# Altium schematic sheet SWAP_21DD_ LV_DR_Brush_Rev1.2.SchDoc
size Letter
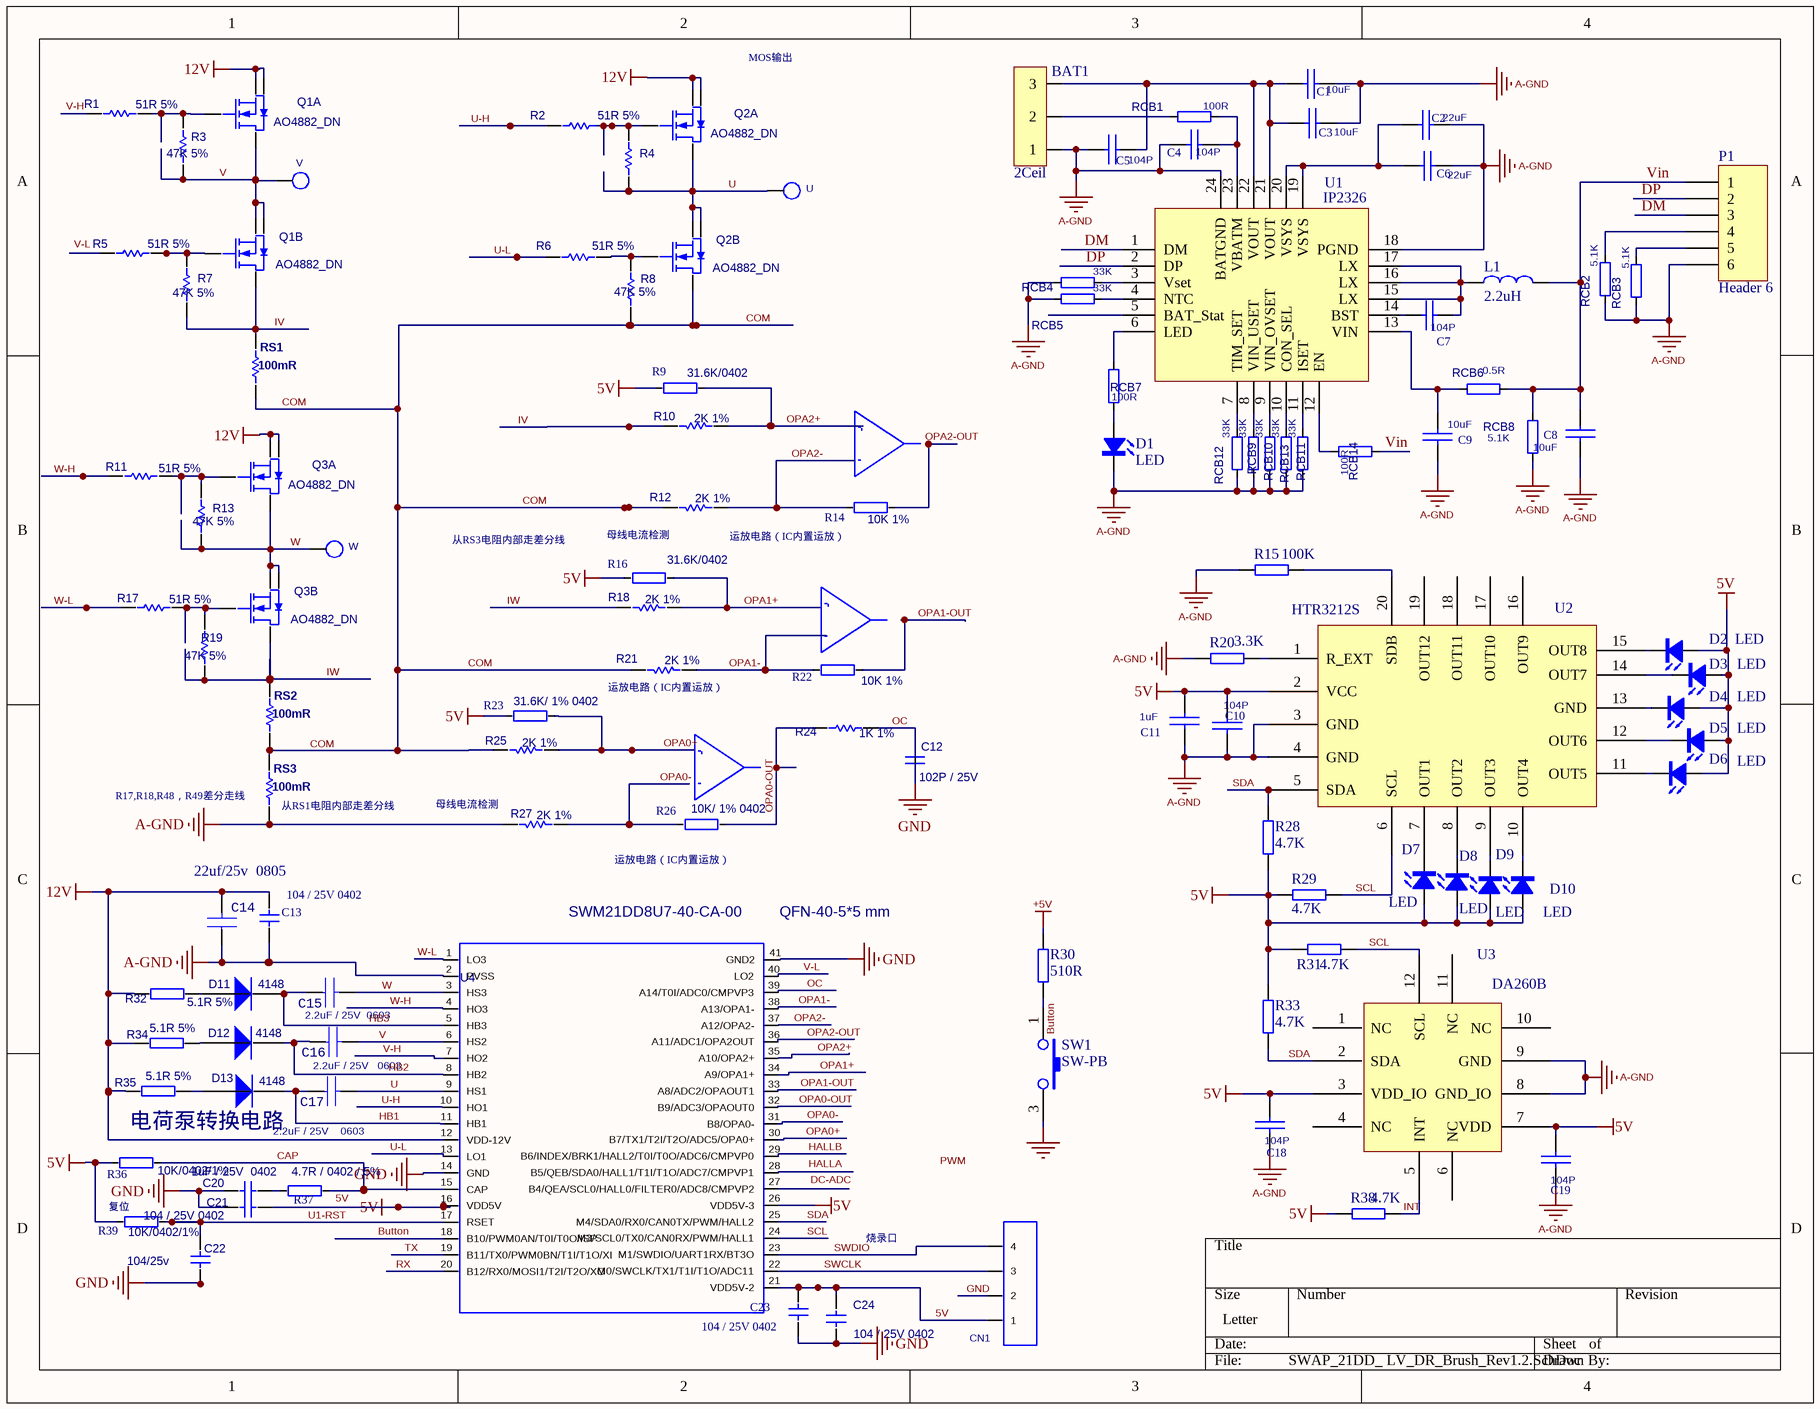
[diagram p0: SWAP_21DD_ LV_DR_Brush_Rev1.2.SchDoc]

## Parts
BAT1  2Ceil  [HDR1X3]
C1  10uF  [LC-0603_R]
C2  22uF  [LC-0603_R]
C3  10uF  [LC-0603_R]
C4  104P  [LC-0603_R]
C5  104P  [LC-0603_R]
C6  22uF  [LC-0603_R]
C7  104P  [LC-0603_R]
C8  10uF  [LC-0603_R]
C9  10uF  [LC-0603_R]
C10  104P  [LC-0603_R]
C11  1uF  [LC-0603_R]
C12  102P / 25V  [LC-0402_C]
C13  104 / 25V 0402  [LC-0402_C]
C14  22uf/25v  0805  [LC-0805_C]
C15  2.2uF / 25V  0603  [LC-0603_C]
C16  2.2uF / 25V   0603  [LC-0603_C]
C17  2.2uF / 25V    0603  [LC-0603_C]
C18  104P  [LC-0603_R]
C19  104P  [LC-0603_R]
C20  1uF / 25V  0402  [LC-0402_C]
C21  104 / 25V 0402  [LC-0402_C]
C22  104/25v  [LC-0402_C]
C23  104 / 25V 0402  [LC-0402_C]
C24  104 / 25V 0402  [LC-0402_C]
CN1  SWD1  [4P-2.54-8]  (value not drawn)
D1  LED  [D0603-B]
D2  LED  [D0603-B]
D3  LED  [D0603-B]
D4  LED  [D0603-B]
D5  LED  [D0603-B]
D6  LED  [D0603-B]
D7  LED  [D0603-B]
D8  LED  [D0603-B]
D9  LED  [D0603-B]
D10  LED  [D0603-B]
D11  4148  [LC-SOD-323]
D12  4148  [LC-SOD-323]
D13  4148  [LC-SOD-323]
L1  2.2uH  [L-5X4]
P1  Header 6  [HDR1X6]
Q1  AO4882_DN  [LC-SOP-8_150mil]  (parts A,B of 2)
Q2  AO4882_DN  [LC-SOP-8_150mil]  (parts A,B of 2)
Q3  AO4882_DN  [LC-SOP-8_150mil]  (parts A,B of 2)
R1  51R 5%  [LC-0402_R]
R2  51R 5%  [LC-0402_R]
R3  47K 5%  [LC-0402_R]
R4  47K 5%  [LC-0402_R]  (value not drawn)
R5  51R 5%  [LC-0402_R]
R6  51R 5%  [LC-0402_R]
R7  47K 5%  [LC-0402_R]
R8  47K 5%  [LC-0402_R]
R9  31.6K/0402  [LC-0402_R]
R10  2K 1%  [LC-0402_R]
R11  51R 5%  [LC-0402_R]
R12  2K 1%  [LC-0402_R]
R13  47K 5%  [LC-0402_R]
R14  10K 1%  [LC-0402_R]
R15  100K  [R 0603]
R16  31.6K/0402  [LC-0402_R]
R17  51R 5%  [LC-0402_R]
R18  2K 1%  [LC-0402_R]
R19  47K 5%  [LC-0402_R]
R20  3.3K  [R 0603]
R21  2K 1%  [LC-0402_R]
R22  10K 1%  [LC-0402_R]
R23  31.6K/ 1% 0402  [LC-0402_R]
R24  1K 1%  [LC-0402_R]
R25  2K 1%  [LC-0402_R]
R26  10K/ 1% 0402  [LC-0402_R]
R27  2K 1%  [LC-0402_R]
R28  4.7K  [R 0603]
R29  4.7K  [R 0603]
R30  510R  [R 0603]
R31  4.7K  [R 0603]
R32  5.1R 5%  [LC-0603_R]
R33  4.7K  [R 0603]
R34  5.1R 5%  [LC-0603_R]
R35  5.1R 5%  [LC-0603_R]
R36  10K/0402/1%  [LC-0402_R]
R37  4.7R / 0402 / 5%  [LC-0402_R]
R38  4.7K  [R 0603]
R39  10K/0402/1%  [LC-0402_R]
RCB1  100R  [LC-0603_R]
RCB2  5.1K  [LC-0603_R]
RCB3  5.1K  [LC-0603_R]
RCB4  33K  [LC-0603_R]
RCB5  33K  [LC-0603_R]
RCB6  0.5R  [LC-0603_R]
RCB7  100R  [LC-0603_R]
RCB8  5.1K  [LC-0603_R]
RCB9  33K  [LC-0603_R]
RCB10  33K  [LC-0603_R]
RCB11  33K  [LC-0603_R]
RCB12  33K  [LC-0603_R]
RCB13  33K  [LC-0603_R]
RCB14  100R  [LC-0603_R]
RS1  100mR  [LC-1206_R]
RS2  100mR  [LC-1206_R]
RS3  100mR  [LC-1206_R]
SW1  SW-PB  [SW]
T1  value V  [MARK]  (hidden comment: TEST)
T2  value U  [MARK]  (hidden comment: TEST)
T3  value W  [MARK]  (hidden comment: TEST)
U1  IP2326  [QFN-24]
U2  HTR3212S  [SOP-20]
U3  DA260B  [SOIC-16]
U4  QFN32  [QFN32]  (value not drawn)

## Nets
5V: C10.1 C11.1 C18.1 C19.1 C21.1 C23.2 C24.2 CN1.1 D2.A D3.A D4.A D5.A D6.A D7.A D8.A D9.A D10.A R9.2 R16.2 R23.2 R28.2 R29.1 R31.1 R33.2 R36.1 R38.2 R39.1 U2.2(VCC) U3.3(VDD_IO) U3.7(VDD) U4.16(VDD5V) U4.21(VDD5V-2) U4.26(VDD5V-3)
12V: C13.2 C14.2 Q1.7(D) Q1.8(D) Q2.7(D) Q2.8(D) Q3.7(D) Q3.8(D) R32.1 R34.1 R35.1 U4.12(VDD-12V)
+5V: R30.1
A-GND: BAT1.1 C1.1 C2.1 C3.1 C4.2 C5.2 C6.1 C8.2 C9.2 C10.2 C11.2 C13.1 C14.1 C18.2 C19.2 D1.K P1.6 R15.2 R20.2 R27.1 RCB2.2 RCB3.2 RCB4.2 RCB5.2 RCB8.2 RCB9.2 RCB10.2 RCB11.2 RCB12.2 RCB13.2 RS3.1 U1.18(PGND) U1.24(BATGND) U2.3(GND) U2.4(GND) U3.8(GND_IO) U3.9(GND) U4.2(PVSS)
GND: C12.1 C20.1 C21.2 C22.2 C23.1 C24.1 CN1.2 SW1.3 U4.14(GND) U4.41(GND2)
Button: R30.2 SW1.1 U4.18(B10/PWM0AN/T0I/T0O/ISP)
CAP: R36.2 R37.2 U4.15(CAP)
COM: Q2.3(S) R8.1 R12.1 R21.1 R25.1 RS1.1 RS2.1 RS3.2
DM: P1.3 U1.1(DM)
DP: P1.2 U1.2(DP)
HALLA: U4.28(B5/QEB/SDA0/HALL1/T1I/T1O/ADC7/CMPVP1)
HALLB: U4.29(B6/INDEX/BRK1/HALL2/T0I/T0O/ADC6/CMPVP0)
HB1: C17.1 D13.2(K) U4.11(HB1)
HB2: C16.1 D12.2(K) U4.8(HB2)
HB3: C15.1 D11.2(K) U4.5(HB3)
INT: R38.1 U3.5(INT)
IV: Q1.3(S) R7.1 R10.1 RS1.2
IW: Q3.3(S) R18.1 R19.1 RS2.2
OC: C12.2 R24.2 U4.39(A14/T0I/ADC0/CMPVP3)
OPA0+: R23.1 R25.2 U4.30(B7/TX1/T2I/T2O/ADC5/OPA0+)
OPA0-: R26.2 R27.2 U4.31(B8/OPA0-)
OPA0-OUT: R24.1 R26.1 U4.32(B9/ADC3/OPAOUT0)
OPA1+: R16.1 R18.2 U4.34(A9/OPA1+)
OPA1-: R21.2 R22.2 U4.38(A13/OPA1-)
OPA1-OUT: R22.1 U4.33(A8/ADC2/OPAOUT1)
OPA2+: R9.1 R10.2 U4.35(A10/OPA2+)
OPA2-: R12.2 R14.2 U4.37(A12/OPA2-)
RX: U4.20(B12/RX0/MOSI1/T2I/T2O/XO)
SCL: R29.2 R31.2 U2.6(SCL) U3.12(SCL) U4.24(M3/SCL0/TX0/CAN0RX/PWM/HALL1)
SDA: R28.1 R33.1 U2.5(SDA) U3.2(SDA) U4.25(M4/SDA0/RX0/CAN0TX/PWM/HALL2)
SWCLK: CN1.3 U4.22(M0/SWCLK/TX1/T1I/T1O/ADC11)
SWDIO: CN1.4 U4.23(M1/SWDIO/UART1RX/BT3O)
TX: U4.19(B11/TX0/PWM0BN/T1I/T1O/XI)
U: C17.2 Q2.1(S) Q2.5(D) Q2.6(D) R4.1 T2.1 U4.9(HS1)
U1-RST: C22.1 R39.2 U4.17(RSET)
U-H: R2.1 U4.10(HO1)
U-L: R6.1 U4.13(LO1)
V: C16.2 Q1.1(S) Q1.5(D) Q1.6(D) R3.1 T1.1 U4.6(HS2)
V-H: R1.1 U4.7(HO2)
V-L: U4.40(LO2)
Vin: C8.1 L1.1 P1.1 RCB6.2 RCB8.1 RCB14.2
W: C15.2 Q3.1(S) Q3.5(D) Q3.6(D) R13.1 T3.1 U4.3(HS3)
W-H: R11.1 U4.4(HO3)
W-L: R17.1 U4.1(LO3)
NetBAT1_2: BAT1.2 RCB1.2
NetBAT1_3: BAT1.3 C1.2 C3.2 C5.1 U1.21(VOUT) U1.22(VOUT)
NetC2_2: C2.2 C6.2 U1.19(VSYS) U1.20(VSYS)
NetC4_1: C4.1 RCB1.1 U1.23(VBATM)
NetC7_1: C7.1 U1.14(BST)
NetC7_2: C7.2 L1.2 U1.15(LX) U1.16(LX) U1.17(LX)
NetC9_1: C9.1 RCB6.1 U1.13(VIN)
NetC20_2: C20.2 R37.1
NetD1_A: D1.A RCB7.1
NetD2_K: D2.K U2.15(OUT8)
NetD3_K: D3.K U2.14(OUT7)
NetD4_K: D4.K U2.13(GND)
NetD5_K: D5.K U2.12(OUT6)
NetD6_K: D6.K U2.11(OUT5)
NetD7_K: D7.K U2.7(OUT1)
NetD8_K: D8.K U2.8(OUT2)
NetD9_K: D9.K U2.9(OUT3)
NetD10_K: D10.K U2.10(OUT4)
NetD11_1: D11.1(A) R32.2
NetD12_1: D12.1(A) R34.2
NetD13_1: D13.1(A) R35.2
NetP1_4: P1.4 RCB2.1
NetP1_5: P1.5 RCB3.1
NetQ1_2: Q1.2(G) R1.2 R3.2
NetQ1_4: Q1.4(G) R5.2
NetQ2_2: Q2.2(G) R2.2 R4.2
NetQ2_4: Q2.4(G) R6.2 R8.2
NetQ3_2: Q3.2(G) R11.2 R13.2
NetQ3_4: Q3.4(G) R17.2 R19.2
NetR15_1: R15.1 U2.20(SDB)
NetR20_1: R20.1 U2.1(R_EXT)
NetRCB4_1: RCB4.1 U1.3(Vset)
NetRCB5_1: RCB5.1 U1.4(NTC)
NetRCB7_2: RCB7.2 U1.6(LED)
NetRCB9_1: RCB9.1 U1.8(VIN_USET)
NetRCB10_1: RCB10.1 U1.9(VIN_OVSET)
NetRCB11_1: RCB11.1 U1.11(ISET)
NetRCB12_1: RCB12.1 U1.7(TIM_SET)
NetRCB13_1: RCB13.1 U1.10(CON_SEL)
NetRCB14_1: RCB14.1 U1.12(EN)

Not connected (* = marked no-connect by the designer): R5 1; R7 2; R14 1; U1 5(BAT_Stat); U2 16(OUT9) 17(OUT10) 18(OUT11) 19(OUT12); U3 1(NC) 4(NC) 6(NC) 10(NC) 11(NC); U4 27(B4/QEA/SCL0/HALL0/FILTER0/ADC8/CMPVP2) 36(A11/ADC1/OPA2OUT)

## Notes on the sheet
- (near Q2) MOS输出
- 从RS3电阻内部走差分线
- 母线电流检测
- (near R12) 运放电路（IC内置运放）
- (near R21) 运放电路（IC内置运放）
- R17,R18,R48，R49差分走线
- (near RS3) 从RS1电阻内部走差分线
- (near R26) 运放电路（IC内置运放）
- (near U4) SWM21DD8U7-40-CA-00
- (near U4) QFN-40-5*5 mm
- 电荷泵转换电路
- (near R39) 复位
- 烧录口
- Labels drawn without touching a wire or pin: 5V, DC-ADC, OPA2-OUT, PWM, V-L

## Library data of the parts
BAT1 = BAT: Connector
C1-C11 C18 C19 = CC: Capacitor; PCB DECAL: C0603
C12 = C0603: 贴片瓷片电容; Value: 100nF; Published: 8-Jun-2000; LatestRevisionDate: 17-Jul-2002; LatestRevisionNote: Re-released for DXP Platform.; PackageReference: RAD-0.3; Publisher: Altium Limited; PCB DECAL: C0603; Comment_1: C0603
C13 C20-C24 = CAP_S: PCB DECAL: C0603; Comment_1: CAP_S
C14 = C0805: SMT Resistor 5% UniOhm(厚声); Part_Shape: 0603; Source_Path: E:\GTCS-A01-SWM-P9项目\GTCS-A01-SWM-P9项目V1.2\GTCS-A01-SWM-P9-V1.2.原理图\99.DSN; ValueRank: 33R; ForPin: Pin; Designator: R1C; Contributor: LCEDA_Lib; Published: 8-Jun-2000; LatestRevisionDate: 17-Jul-2002; LatestRevisionNote: Re-released for DXP Platform.; PackageReference: 0805; Publisher: Altium Limited; PackageDescription: Radial Cap, Thru-Hole; 2 Leads; 0.3 in Pin Spacing; PCB DECAL: C0805; MountType: SMT; Footprint: 0805; Accuracy: 5%; spicePre: R; spiceSymbolName: R_0603_EU; Comment_1: C0805
C15-C17 = C0805: Part_Shape: 0603; Source_Path: E:\GTCS-A01-SWM-P9项目\GTCS-A01-SWM-P9项目V1.2\GTCS-A01-SWM-P9-V1.2.原理图\99.DSN; PCB DECAL: C0805
CN1 = 4P-2.54-8: 接插件  DS-5.1CN4  DS-2.54CWB-4; PCB DECAL: 4P-2.54-8; Comment_1: 4P-2.54-8
D11-D13 = DIODE: Default Diode; PCB DECAL: SOD-123/3; Published: 8-Jun-2000; LatestRevisionDate: 17-Jul-2002; LatestRevisionNote: Re-released for DXP Platform.; PackageVersion: Sep-1996; PackageReference: SMC; Publisher: Altium Limited; PackageDescription: DO-214-AB/SMC; 2 C-Bend Leads; Body 7.9 x 5.9 mm, inc. leads (LxW); Code_JEDEC: DO-214-AB; Comment_1: DIODE
L1 = L - 5x4: 电感
P1 = Header 6: Header, 6-Pin; LatestRevisionDate: 17-Jul-2002; LatestRevisionNote: Re-released for DXP Platform.; Publisher: Altium Limited
Q1-Q3 = AO4882_DN_SOP8: MOS(场效应管)
R1-R8 R10-R13 R17-R19 R21 R25 R27 = RES_SEMI: Semiconductor Resistor; Value: 1K; PCB DECAL: R0603; Published: 8-Jun-2000; LatestRevisionDate: 17-Jul-2002; LatestRevisionNote: Re-released for DXP Platform.; PackageReference: AXIAL-0.5; Publisher: Altium Limited; PackageDescription: Axial Device, Thru-Hole; 2 Leads; 0.5 in Pin Spacing; Comment_1: RES_SEMI
R9 R14 R16 R22 R23 R26 R36 R37 R39 = R0402: 贴片电阻; Value: 1K; PCB DECAL: R0603; Published: 8-Jun-2000; LatestRevisionDate: 17-Jul-2002; LatestRevisionNote: Re-released for DXP Platform.; Publisher: Altium Limited; Comment_1: R0402
  R9 R14 R16 R22 R23 R26: PackageReference: AXIAL-0.5; PackageDescription: Axial Device, Thru-Hole; 2 Leads; 0.5 in Pin Spacing
  R36 R37 R39: PackageReference: AXIAL-0.4
R15 R20 R28-R31 R33 R38 = R: Resistance
R24 = RES_SEMI: Semiconductor Resistor; PCB DECAL: R0603; Published: 8-Jun-2000; LatestRevisionDate: 17-Jul-2002; LatestRevisionNote: Re-released for DXP Platform.; PackageReference: AXIAL-0.5; Publisher: Altium Limited; PackageDescription: Axial Device, Thru-Hole; 2 Leads; 0.5 in Pin Spacing; Value: 1K; Comment_1: RES_SEMI
R32 R34 R35 = RES_T: PCB DECAL: R1206; Comment_1: RES_T
RCB1-RCB14 = RR: 贴片 电阻器; Value: 1K; PCB DECAL: R0603; SMD/DIP/WELDING: SMD; Published: 8-Jun-2000; LatestRevisionDate: 17-Jul-2002; LatestRevisionNote: Re-released for DXP Platform.; PackageReference: AXIAL-0.5; Publisher: Altium Limited; PackageDescription: Axial Device, Thru-Hole; 2 Leads; 0.5 in Pin Spacing
RS1-RS3 = RES_2512: Semiconductor Resistor; Value: 1K; PCB DECAL: 2512R_6332; Published: 8-Jun-2000; LatestRevisionDate: 17-Jul-2002; LatestRevisionNote: Re-released for DXP Platform.; PackageReference: AXIAL-0.5; Publisher: Altium Limited; PackageDescription: Axial Device, Thru-Hole; 2 Leads; 0.5 in Pin Spacing; Comment_1: RES_2512
T1-T3 = TEST: Source_Path: C:\USERS\ADMINISTRATOR\DESKTOP\ORCAD元件库\Y-MYLIBRARY.OLB; PCB DECAL: TEST
U4 = SWM21DD8U7: PCB DECAL: SWM21DK6U7_QFN32_5X5_BA00